# Altium schematic sheet schematic.SchDoc
size B; SheetNumber: 1; SheetTotal: 1
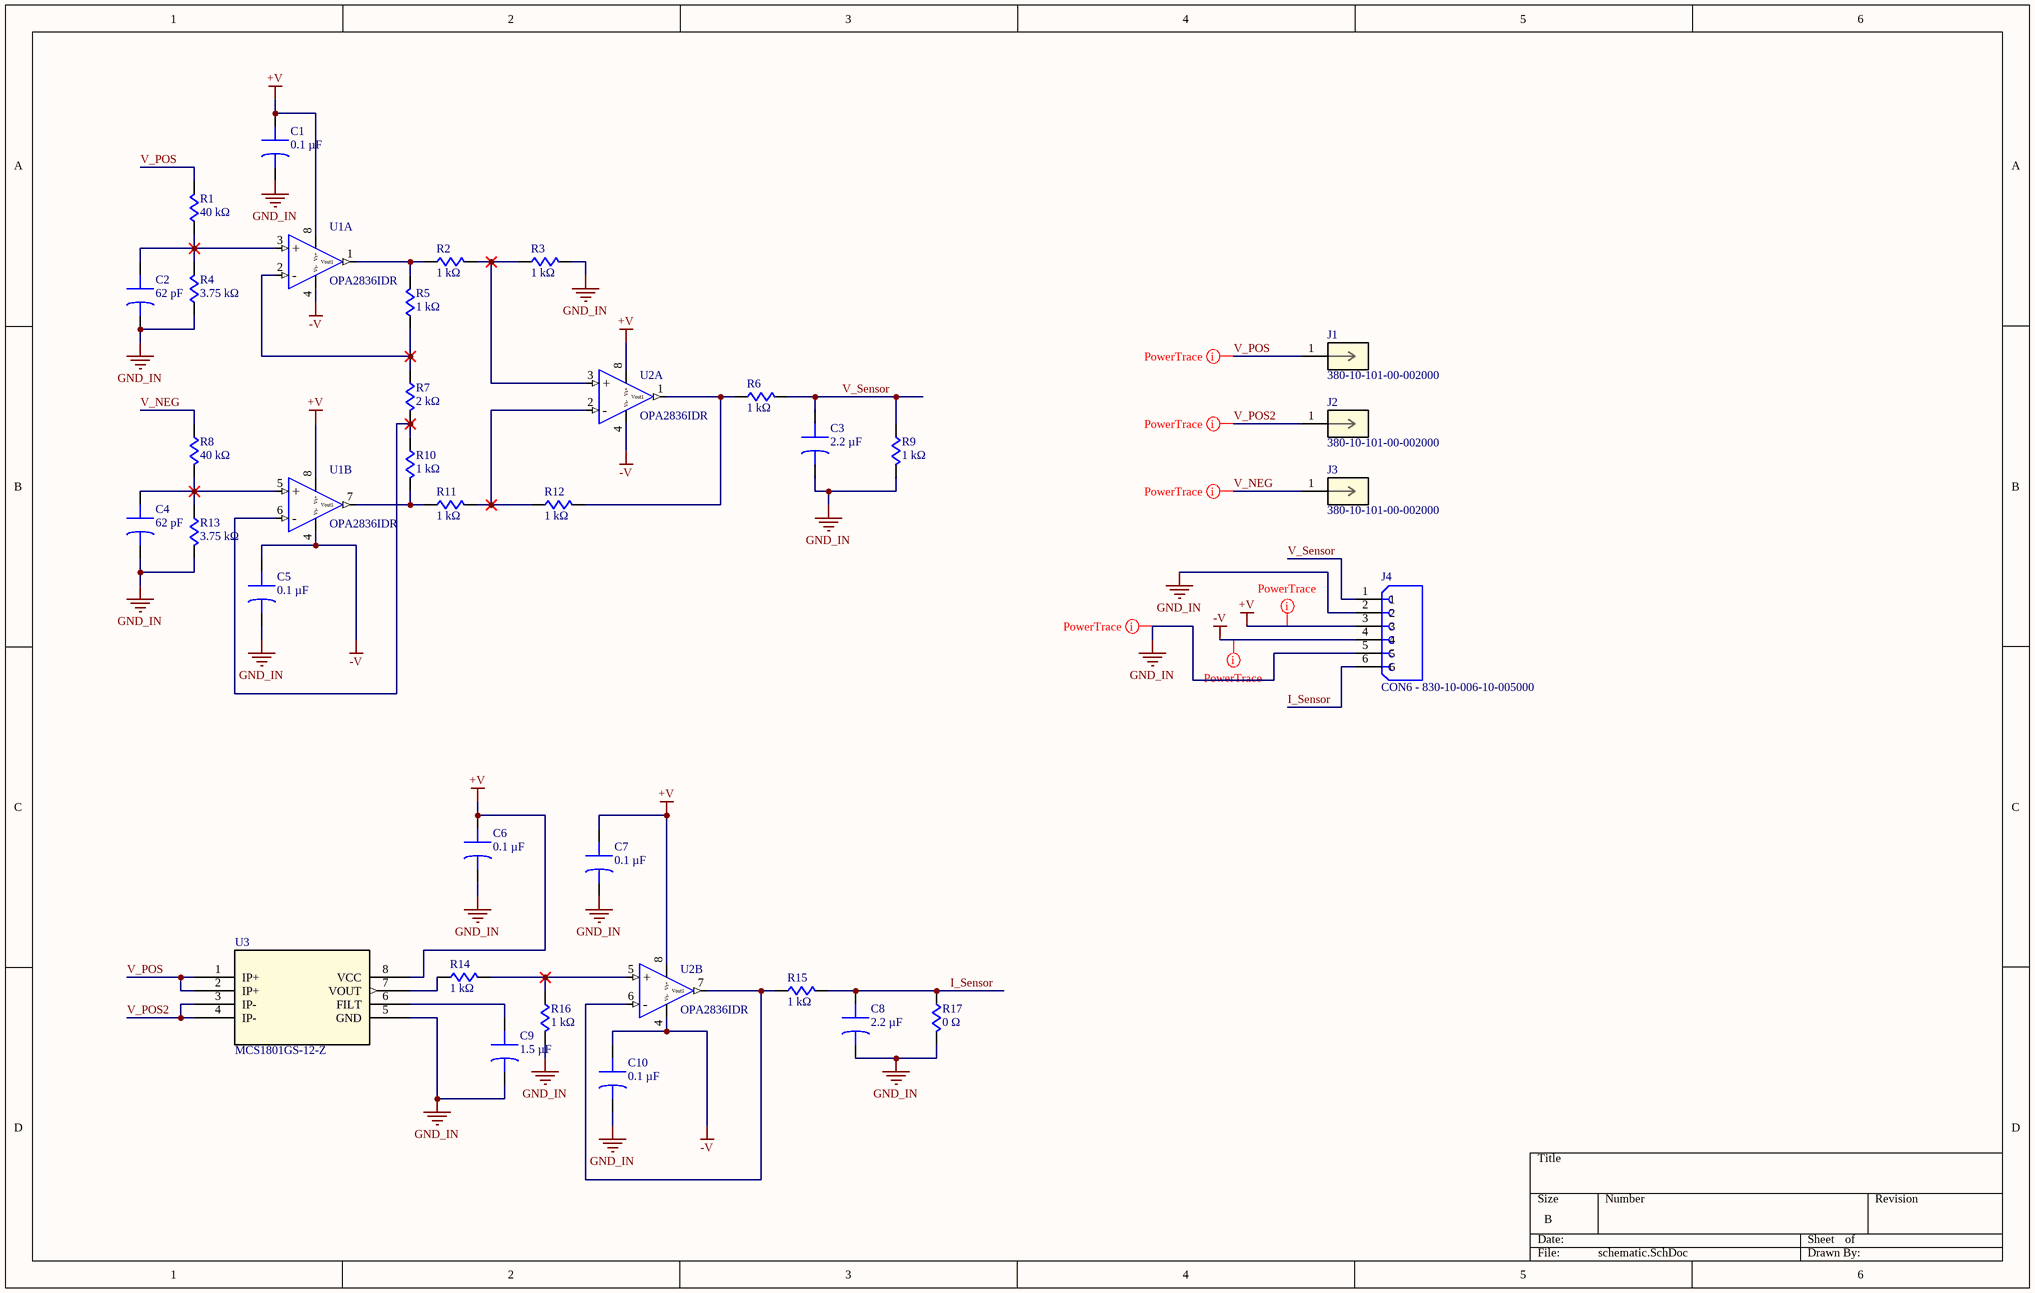
[diagram p0: schematic.SchDoc]

## Parts
C1  0.1 µF  [C0805]
C2  62 pF  [C0805]
C3  2.2 µF  [C0805]
C4  62 pF  [C0805]
C5  0.1 µF  [C0805]
C6  0.1 µF  [C0805]
C7  0.1 µF  [C0805]
C8  2.2 µF  [C0805]
C9  1.5 µF  [C0805]
C10  0.1 µF  [C0805]
J1  380-10-101-00-002000  [CON1 - 7466005R]
J2  380-10-101-00-002000  [CON1 - 7466005R]
J3  380-10-101-00-002000  [CON1 - 7466005R]
J4  CON6 - 830-10-006-10-005000  [MILL-MAX_830-10-006-10-005000 - duplicate]
R1  40 kΩ  [R0805]
R2  1 kΩ  [R0805]
R3  1 kΩ  [R0805]
R4  3.75 kΩ  [R0805]
R5  1 kΩ  [R0805]
R6  1 kΩ  [R0805]
R7  2 kΩ  [R0805]
R8  40 kΩ  [R0805]
R9  1 kΩ  [R0805]
R10  1 kΩ  [R0805]
R11  1 kΩ  [R0805]
R12  1 kΩ  [R0805]
R13  3.75 kΩ  [R0805]
R14  1 kΩ  [R0805]
R15  1 kΩ  [R0805]
R16  1 kΩ  [R0805]
R17  0 Ω  [R0805]
U1  OPA2836IDR  [SOIC8 - SOIC127P599X175-8N]  (parts A,B of 2)
U2  OPA2836IDR  [SOIC8 - SOIC127P599X175-8N]  (parts A,B of 2)
U3  MCS1801GS-12-Z  [SOIC8 - SOIC127P599X175-8N]

## Nets
+V: C1.1 C6.1 C7.1 J4.3 U1.8(Vs+) U2.8(Vs+) U3.8(VCC)
-V: C5.1 C10.1 J4.4 U1.4(Vs-) U2.4(Vs-)
GND_IN: C1.2 C2.2 C3.2 C4.2 C5.2 C6.2 C7.2 C8.2 C9.2 C10.2 J4.2 J4.5 R3.2 R4.1 R9.2 R13.2 R16.2 R17.2 U3.5(GND)
I_Sensor: C8.1 J4.6 R15.2 R17.1
V_NEG: J3.1 R8.1
V_POS: J1.1 R1.2 U3.1(IP+) U3.2(IP+)
V_POS2: J2.1 U3.3(IP-) U3.4(IP-)
V_Sensor: C3.1 J4.1 R6.2 R9.1
NetC2_1: C2.1 R1.1 R4.2 U1.3(+)
NetC4_1: C4.1 R8.2 R13.1 U1.5(+)
NetC9_1: C9.1 U3.6(FILT)
NetR2_1: R2.1 R5.2 U1.1(Vout1)
NetR2_2: R2.2 R3.1 U2.3(+)
NetR5_1: R5.1 R7.1 U1.2(-)
NetR6_1: R6.1 R12.2 U2.1(Vout1)
NetR7_2: R7.2 R10.1 U1.6(-)
NetR10_2: R10.2 R11.1 U1.7(Vout1)
NetR11_2: R11.2 R12.1 U2.2(-)
NetR14_1: R14.1 U3.7(VOUT)
NetR14_2: R14.2 R16.1 U2.5(+)
NetR15_1: R15.1 U2.6(-) U2.7(Vout1)

## Layout directives
rule Width Constraint [Pref Width = 20mil    Min Width = 20mil    Max Width = 100mil]: +V, -V, GND_IN, V_NEG, V_POS, V_POS2

## Library data of the parts
C1-C10 = Unkown_Capacitor: SMD Capacitor
J1-J3 = CONN_BUSH - 380-10-101-00-002000: No Description Available; Mfr_Name: Mill-Max; Copyright: Copyright (C) 2022 Ultra Librarian. All rights reserved.; Manufacturer_Part_Number: 380-10-101-00-002000; Digi-Key_Part_Number_1: ED10251-ND; RefDes: RefDes; Type: DEV
J4 = CON6 - 830-10-006-10-005000: 6 Position Header Connector Solder Cup Gold; MF: Mill-Max Manufacturing Corp.; Price: None; Value: *; Check_prices: https://www.snapeda.com/parts/830-10-006-10-005000/Mill-Max%20Manufacturing%20Corp./view-part/6308393/?ref=eda; Package: None; SnapEDA_Link: https://www.snapeda.com/parts/830-10-006-10-005000/Mill-Max%20Manufacturing%20Corp./view-part/6308393/?ref=snap; Purchase-URL: https://pricing.snapeda.com/search/part/830-10-006-10-005000/?ref=eda; Availability: In Stock; MP: 830-10-006-10-005000
R1-R17 = Unknown_Resistor: SMD Resistor
U1 U2 = OPA2836IDR: Dual, Very Low Power, Rail to Rail out, Negative Rail in, VFB Op Amp 8-SOIC -40 to 125; Manufacturer: Texas Instruments; Unity Gain Bandwidth Product: 118MHz; Common Mode Rejection Ratio: 94dB; Min Dual Supply Voltage: 1.25V; Max Dual Supply Voltage: 2.75V; Voltage Gain: 122dB; -3db Bandwidth: 205MHz; Number of Channels: 2; Slew Rate: 560V/µs; Max I/O Voltage: 400uV; Max Supply Voltage: 5.5V; Min Supply Voltage: 2.5V; Input Offset Voltage (Vos): 65uV; Input Bias Current: 1uA; Operating Supply Current: 1mA; Output Current per Channel: 50mA; Settling Time: 30ns; Supplier 1: Digi-Key; Manufacturer Part Number: OPA2836IDR; RoHS: Yes; Category: Amplifiers - Op Amps, Buffer, Instrumentation; Stock 1: 4615; Pricing 1: 1=4.26000, 10=3.83000, 25=3.62040, 100=3.13770, 250=2.97680, 500=2.67108, 1000=2.42880 (USD); Case/Package: D; Number of Pins: 8; Contact Plating: Gold; Min Operating Temperature: -40°C; Max Operating Temperature: 125°C; Packaging: Tape and Reel; Package Quantity: 2500; Gain Bandwidth Product: 118MHz; Number of Circuits: 2; Number of Elements: 2; Power Supply Rejection Ratio (PSRR): 94dB; Series: OPA2836; Radiation Hardening: No; Lead Free: Lead Free; RoHS Compliant: Yes; ComponentLink1URL: https://datasheet.ciiva.com/14461/opa2836-14461366.pdf?src-supplier=Avnet; ComponentLink1Description: Data Sheet; ComponentLink2URL: https://datasheet.ciiva.com/1815/opa2836-1815388.pdf?src-supplier=Digi-Key; ComponentLink2Description: Data Sheet; Supplier Part Number 1: 296-OPA2836IDRCT-ND
U3 = MCS1801GS-12-Z_1: No Description Available; Mfr_Name: Monolithic Power Systems; Copyright: Copyright (C) 2022 Ultra Librarian. All rights reserved.; Manufacturer_Part_Number: MCS1801GS-12-Z; Digi-Key_Part_Number_1: 1589-MCS1801GS-12-ZTR-ND; Digi-Key_Part_Number_2: 1589-MCS1801GS-12-ZCT-ND; Digi-Key_Part_Number_3: 1589-MCS1801GS-12-ZDKR-ND; RefDes: RefDes; Type: DEV